# Altium schematic sheet Main.SchDoc
size A4; SheetNumber: 1; SheetTotal: 6
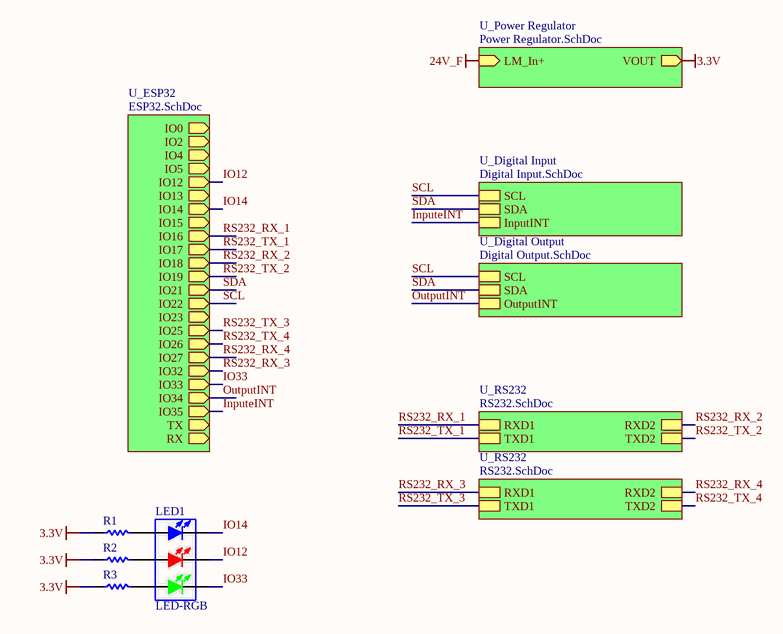
[diagram p0: Main.SchDoc]

## Parts
LED1  LED-RGB  [LED 3535]
R1  1K  [R 0805]  (value not drawn)
R2  1K  [R 0805]  (value not drawn)
R3  1K  [R 0805]  (value not drawn)

## Sub-sheets
U_Digital Input = Digital Input.SchDoc: SCL, SDA, InputINT
U_Digital Output = Digital Output.SchDoc: SCL, SDA, OutputINT
U_ESP32 = ESP32.SchDoc: IO2 (out), IO4 (out), IO5 (out), IO12 (out), IO13 (out), IO14 (out), IO15 (out), IO16 (out), IO17 (out), IO18 (out), IO19 (out), IO21 (out), IO22 (out), IO23 (out), IO25 (out), IO26 (out), IO27 (out), IO32 (out), IO33 (out), IO34 (out), IO35 (out), IO0 (out), TX (out), RX (out)
U_Power Regulator = Power Regulator.SchDoc: LM_In+ (in), VOUT (out)
U_RS232 = RS232.SchDoc: TXD1, TXD2, RXD1, RXD2
U_RS232 = RS232.SchDoc: TXD1, TXD2, RXD1, RXD2

## Nets
3.3V: R1.1 R2.1 R3.1 ; sheet U_Power Regulator/VOUT
24V_F: sheet U_Power Regulator/LM_In+
InputeINT: sheet U_ESP32/IO35, sheet U_Digital Input/InputINT
IO12: LED1.5(RED_K) ; sheet U_ESP32/IO12
IO14: LED1.6(BULE_K) ; sheet U_ESP32/IO14
IO33: LED1.4(GREEN_K) ; sheet U_ESP32/IO33
OutputINT: sheet U_ESP32/IO34, sheet U_Digital Output/OutputINT
RS232_RX_1: sheet U_ESP32/IO16, sheet U_RS232/RXD1
RS232_RX_2: sheet U_ESP32/IO18, sheet U_RS232/RXD2
RS232_RX_3: sheet U_ESP32/IO32, sheet U_RS232/RXD1
RS232_RX_4: sheet U_ESP32/IO27, sheet U_RS232/RXD2
RS232_TX_1: sheet U_ESP32/IO17, sheet U_RS232/TXD1
RS232_TX_2: sheet U_ESP32/IO19, sheet U_RS232/TXD2
RS232_TX_3: sheet U_ESP32/IO25, sheet U_RS232/TXD1
RS232_TX_4: sheet U_ESP32/IO26, sheet U_RS232/TXD2
SCL: sheet U_ESP32/IO22, sheet U_Digital Output/SCL, sheet U_Digital Input/SCL
SDA: sheet U_ESP32/IO21, sheet U_Digital Output/SDA, sheet U_Digital Input/SDA
NetLED1_1: LED1.1(BULE_A) R1.2
NetLED1_2: LED1.2(RED_A) R2.2
NetLED1_3: LED1.3(GREEN_A) R3.2

## Library data of the parts
LED1 = LED-RGB: Three primary color LED; BOM名称: 三基色LED; 版权归属: 源创客; 学习资源: www.ooocke.com
R1-R3 = R: Chip resistor; 版权归属: 源创客; BOM名称: Chip resistor; 学习资源: www.ooocke.com